# Altium schematic sheet PAGE3-ERRATA.SchDoc
size A3
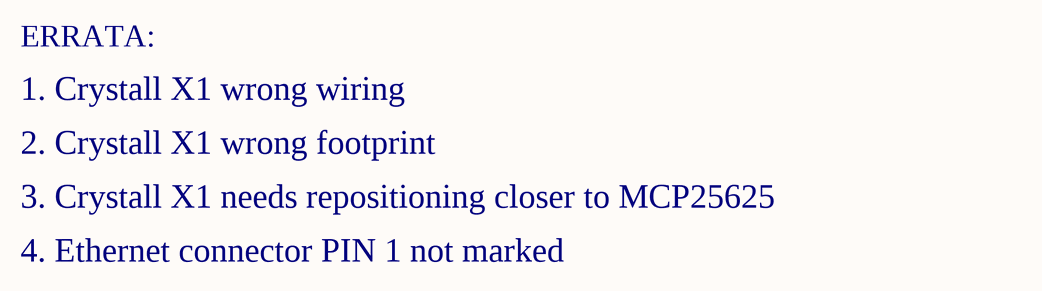
[diagram p0: PAGE3-ERRATA.SchDoc]

## Notes on the sheet
- ERRATA:
- 1. Crystall X1 wrong wiring
- 2. Crystall X1 wrong footprint
- 3. Crystall X1 needs repositioning closer to MCP25625
- 4. Ethernet connector PIN 1 not marked